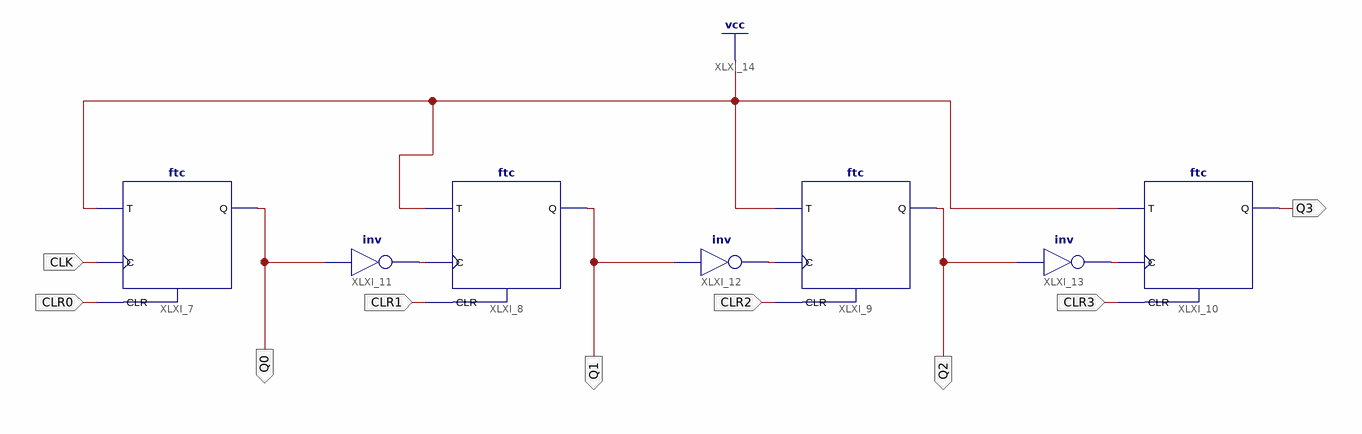
[diagram p0: schematic sheet 1]
// Xilinx ISE schematic Modulo_Sixteen_Ripple_Counter.sch (spartan3e) as structural Verilog: 7 symbols, 9 ports
module Modulo_Sixteen_Ripple_Counter (
  input  CLK,
  input  CLR0,
  input  CLR1,
  input  CLR2,
  input  CLR3,
  output Q0,
  output Q1,
  output Q2,
  output Q3
);

  wire XLXN_2, XLXN_3, XLXN_4;

  ftc XLXI_7 (.C(CLK), .CLR(CLR0), .T(1'b1), .Q(Q0));
  ftc XLXI_8 (.C(XLXN_2), .CLR(CLR1), .T(1'b1), .Q(Q1));
  ftc XLXI_9 (.C(XLXN_3), .CLR(CLR2), .T(1'b1), .Q(Q2));
  ftc XLXI_10 (.C(XLXN_4), .CLR(CLR3), .T(1'b1), .Q(Q3));
  not XLXI_11 (XLXN_2, Q0);
  not XLXI_12 (XLXN_3, Q1);
  not XLXI_13 (XLXN_4, Q2);
endmodule
